# EAGLE design app_jalousie_up_v0_1 (EAGLE 4.16)
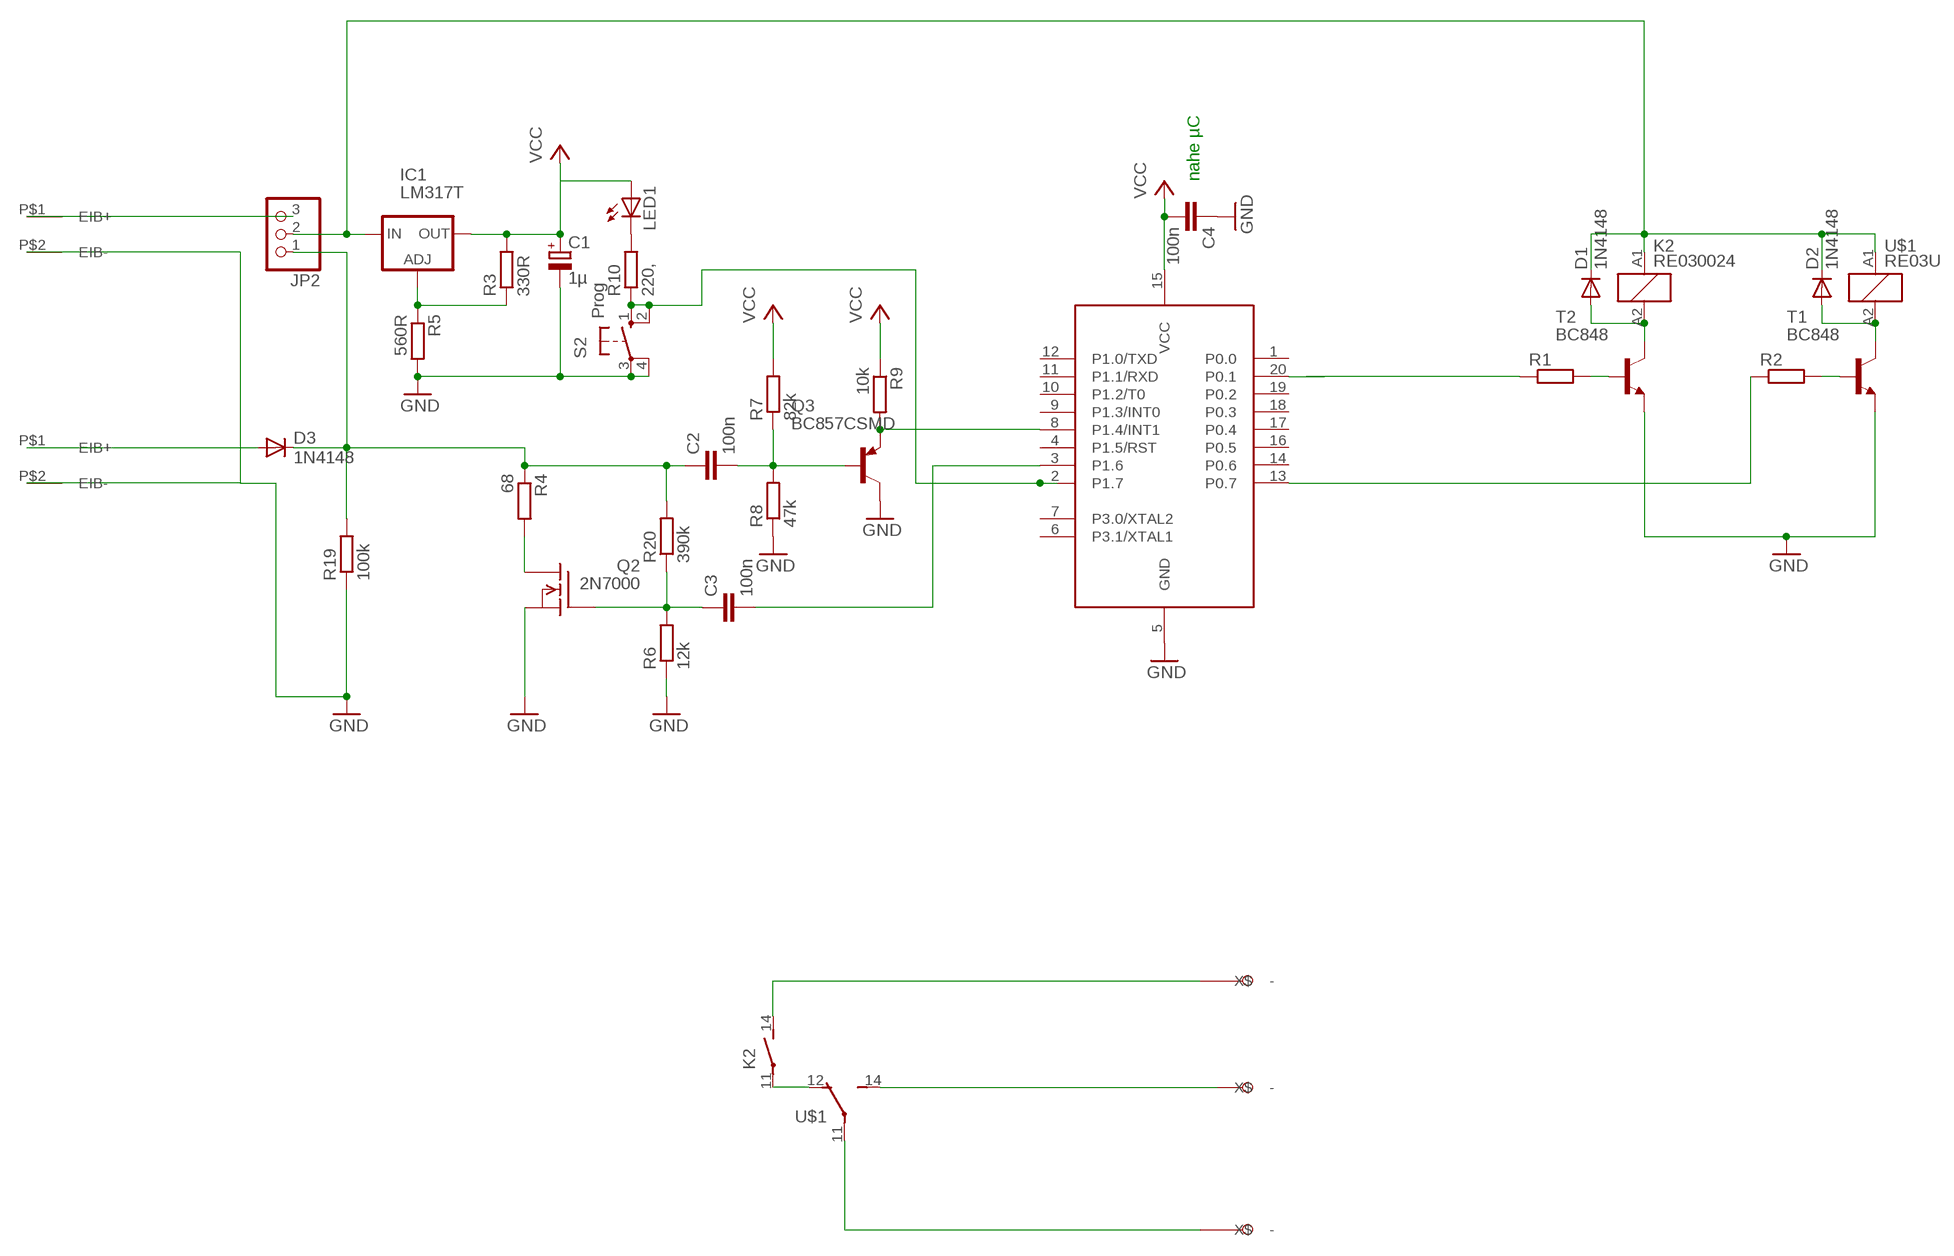
[diagram p0: schematic, sheet 1]

## Parts
C1  1µ  CPOL-EUCT3528  [CT3528]
C2  100n  C-EUC0805  [C0805]
C3  100n  C-EUC0805  [C0805]
C4  100n  C-EUC0805  [C0805]
D1  1N4148  DIODE-SOD80C  [SOD80C]
D2  1N4148  DIODE-SOD80C  [SOD80C]
D3  1N4148  DIODE-SOD80C  [SOD80C]
DOWN  SCHRAUBKLEMME  [SCHRAUBKLEMME_PAC]
IC1  LM317T  LM317L  [317L]
JP2  PINHD-1X3  [1X03]
K2  RE030024  [RE-SCHRACK]
L1  SCHRAUBKLEMME  [SCHRAUBKLEMME_PAC]
LED1  LEDCHIPLED_1206  [CHIPLED_1206]
Q2  2N7000  VN2222KM  [TO237]
Q3  BC857CSMD  [SOT23-BEC]
R1  R-EU_M0805  [M0805]
R2  R-EU_M0805  [M0805]
R3  330R  R-EU_R0805  [R0805]
R4  68  R-EU_R0805  [R0805]
R5  560R  R-EU_R0805  [R0805]
R6  12k  R-EU_R0805  [R0805]
R7  82k  R-EU_R0805  [R0805]
R8  47k  R-EU_R0805  [R0805]
R9  10k  R-EU_R0805  [R0805]
R10  220,  R-EU_R0805  [R0805]
R19  100k  R-EU_R0805  [R0805]
R20  390k  R-EU_R0805  [R0805]
S2  Prog  10-XX_SMD  [B3F-10XX_SMD]
T1  BC848  [SOT23]
T2  BC848  [SOT23]
U1  89LPC922  [DIL20]
U$1  RE03U  [G5Q_1_EU]
U$2  BUSKLEMME  [BUSKLEMME]
U$3  BUSKLEMME  [BUSKLEMME]
UP  SCHRAUBKLEMME  [SCHRAUBKLEMME_PAC]

## Nets
GND: C1.- C4.1 Q2.3(S) Q3.C R5.2 R6.1 R8.1 R19.1 S2.3(P) S2.4(P1) T1.2(E) T2.2(E) U1.5(GND) U$2.P$2(EIB-) U$3.P$2(EIB-)
N$1: K2.11(2:P) U$1.12(14:O)
N$2: L1.P$2(-) U$1.11(14:P)
N$3: DOWN.P$2(-) K2.14(2:S)
N$4: U$1.14(14:S) UP.P$1(X$)
N$5: Q2.1(D) R4.2
N$6: D2.A T1.3(C) U$1.A2
N$7: R2.2 T1.1(B)
N$8: R1.2 T2.1(B)
N$9: D1.A K2.A2 T2.3(C)
N$10: LED1.C R10.2
N$11: Q3.E R9.2 U1.8(P1.4/INT1)
N$12: C2.2 Q3.B R7.1 R8.2
N$13: C3.2 U1.3(P1.6)
N$15: IC1.1(ADJ) R3.1 R5.1
N$16: C2.1 D3.C JP2.1 R4.1 R19.2 R20.2
N$17: R10.1 S2.1(S) S2.2(S1) U1.2(P1.7)
N$18: D1.C D2.C IC1.3(IN) JP2.2 K2.A1 U$1.A1
N$19: R2.1 U1.13(P0.7)
N$20: JP2.3 U$2.P$1(EIB+)
N$21: D3.A U$3.P$1(EIB+)
N$35: C3.1 Q2.2(G) R6.2 R20.1
P0.1: R1.1 U1.20(P0.1)
VCC: C1.+ C4.2 IC1.2(OUT) LED1.A R3.2 R7.2 R9.1 U1.15(VCC)
Unconnected: DOWN.P$1(X$) L1.P$1(X$) U1.1(P0.0) U1.4(P1.5/RST) U1.6(P3.1/XTAL1) U1.7(P3.0/XTAL2) U1.9(P1.3/INT0) U1.10(P1.2/T0) U1.11(P1.1/RXD) U1.12(P1.0/TXD) U1.14(P0.6) U1.16(P0.5) U1.17(P0.4) U1.18(P0.3) U1.19(P0.2) UP.P$2(-)

## Notes on the sheet
- nahe µC

## Library data of the parts
C1 = rcl:CPOL-EU: POLARIZED CAPACITOR, European symbol
C2-C4 = rcl:C-EU: CAPACITOR, European symbol
D1-D3 = diode:DIODE-: DIODE
DOWN L1 UP = freebus:SCHRAUBKLEMME
IC1 = v-reg:LM317L: VOLTAGE REGULATOR
JP2 = pinhead:PINHD-1X3: PIN HEADER
K2 = relay:RE03*: Miniature PCB Relay 1 pole 6 A SCHRACK Source: http://www.schrack.com/.. 5812.pdf
LED1 = led:LED: LED OSRAM: - CHIPLED LG R971, LG N971, LY N971, LG Q971, LY Q971, LO R971, LY R971 LH N974, LH R974 LS Q976, LO Q976, LY Q976 LO Q996 - Hyper CHIPLED LW Q18S LB Q993, LB Q99A, LB R99A - SideLED LS A670, LO A670, LY A670, LG A670, LP A670 LB A673, LV A673, LT A673, LW A673 LH A674 LY A675 LS A676, LA A676, LO A676, LY A676, LW A676 LS A679, LY A679, LG A679 - Hyper Micro SIDELED® LS Y876, LA Y876, LO Y876, LY Y876 LT Y87S - SmartLED LW L88C, LW L88S LB L89C, LB L89S, LG L890 LS L89K, LO L89K, LY L89K LS L896, LA L896, LO L896, LY L896 - TOPLED LS T670, LO T670, LY T670, LG T670, LP T670 LSG T670, LSP T670, LSY T670, LOP T670, LYG T670 LG T671, LOG T671, LSG T671 LB T673, LV T673, LT T673, LW T673 LH T674 LS T676, LA T676, LO T676, LY T676, LB T676, LH T676, LSB T676, LW T676 LB T67C, LV T67C, LT T67C, LS T67K, LO T67K, LY T67K, LW E67C LS E67B, LA E67B, LO E67B, LY E67B, LB E67C, LV E67C, LT E67C LW T67C LS T679, LY T679, LG T679 LS T770, LO T770, LY T770, LG T770, LP T770 LB T773, LV T773, LT T773, LW T773 LH T774 LS E675, LA E675, LY E675, LS T675 LS T776, LA T776, LO T776, LY T776, LB T776 LHGB T686 LT T68C, LB T68C - Hyper Mini TOPLED® LB M676 - Mini TOPLED Santana® LG M470 LS M47K, LO M47K, LY M47K Source: http://www.osram.convergy.de/
Q2 = transistor-fet:VN2222KM: N-Channel Enhancement MOSFET (VMOS); 60V; 0,5A; 7,5Ohm
Q3 = transistor-pnp:BC857*: PNP Transistror
R1-R10 R19 R20 = rcl:R-EU_: RESISTOR, European symbol
S2 = switch-omron:10-XX_SMD
T1 T2 = transistor:BC848: NPN TRANSISTOR
U1 = micro-philips:89LPC922
U$1 = freebus_relay:RE03U
U$2 U$3 = freebus:BUSKLEMME

## Board
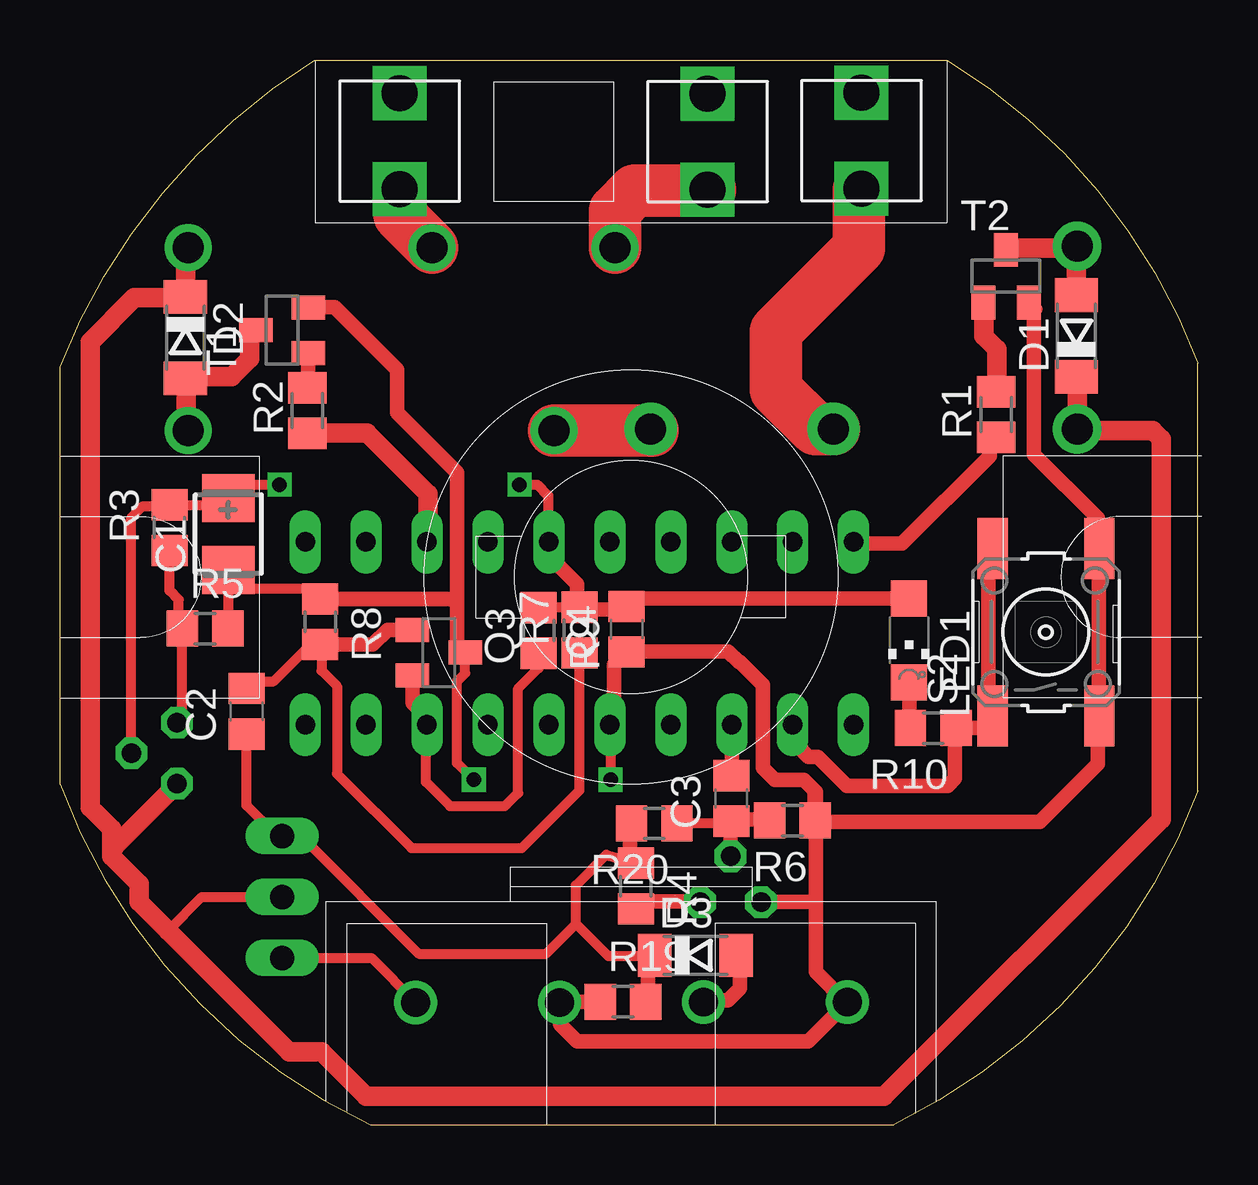
[diagram p1: board, top side]
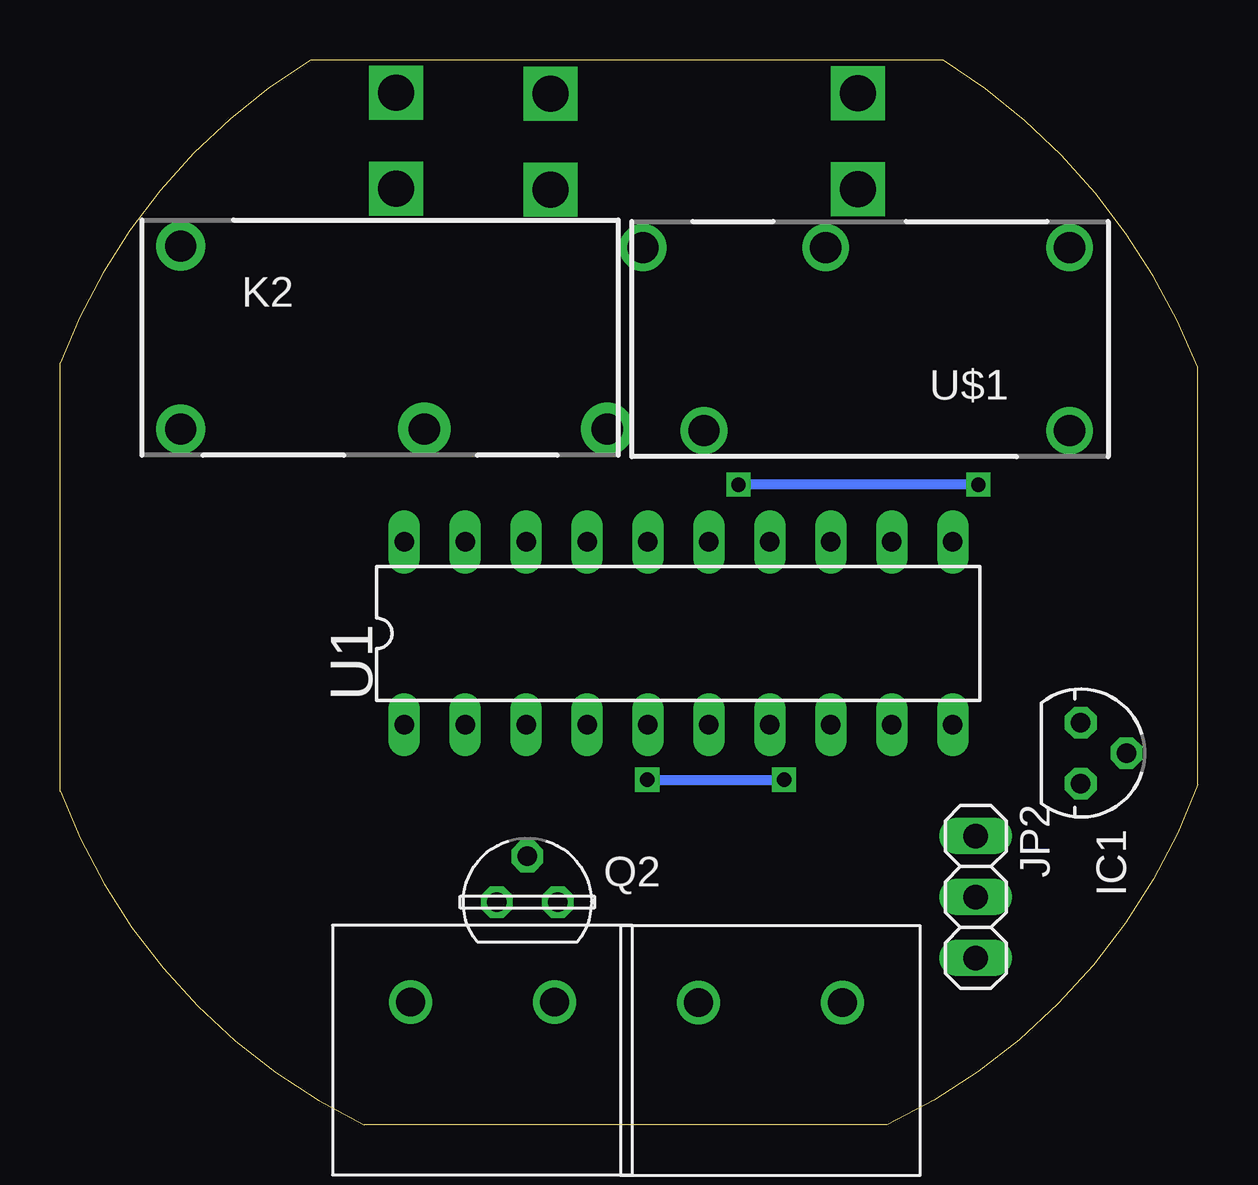
[diagram p2: board, bottom side, seen from below]

Size 47.43 x 44.38 mm. Coordinates in mm from the lower left corner, seen from the top.
Outline: 10.62,44.38 36.96,44.38
Outline: 47.42,13.9 47.43,31.75
Outline: 12.95,0 34.75,0
Outline: 12.95,0 arc-44 0,14.19 0,31.58 arc-36 10.61,44.38
Outline: 36.98,44.38 arc-38 47.43,31.76
Outline: 47.42,13.91 arc-44 34.75,0
Copper layers (1*16): Top 0.035mm / dielectric 1.5mm / Bottom 0.035mm
Design rules "default": minimum track width 10mil, minimum drill 24mil, track to track 8mil, track to pad 8mil, pad to pad 8mil, via to via 8mil, smd to smd 8mil, copper to edge 40mil, drill to drill 8mil, minimum pad ring 10mil, minimum via ring 8mil, stop-mask expansion 4mil, vias tented up to drill 0mil, thermal gap 10mil

### Footprints (pad centres in the part's own frame; a part is rotated, then mirrored left to right if it is on the bottom)
CT3528 = smd 2 x 2.2: + 1.5,0; - -1.5,0
C0805 = smd 1.3 x 1.5: 1 -0.95,0; 2 0.95,0
SOD80C = smd 1.4 x 1.8: A 1.7,0; C -1.7,0
SCHRAUBKLEMME_PAC = drill 1.5 pad 1.93 square: P$1 -2,0; P$2 2,0
317L = drill 0.813 octagon: 1 -1.27,0; 2 0,1.905; 3 1.27,0
1X03 = drill 1.016 long: 1 -2.54,0; 2 0,0; 3 2.54,0
RE-SCHRACK = drill 1.3 pad 2.184 round: 11 8.89,-3.81; 14 1.27,-3.81 | drill 1.3 pad 2.032 round: A1 -8.89,-3.81; A2 -8.89,3.81
CHIPLED_1206 = smd 1.5 x 1.5: A 0,-1.75; C 0,1.75
TO237 = drill 0.813 octagon: 1 1.27,0; 2 0,1.905; 3 -1.27,0
SOT23-BEC = smd 1 x 1.4: B -0.95,-1.1; C 0,1.1; E 0.95,-1.1
M0805 = smd 1.3 x 1.6: 1 -0.95,0; 2 0.95,0
R0805 = smd 1.3 x 1.5: 1 -0.95,0; 2 0.95,0
B3F-10XX_SMD = smd 2.54 x 1.27: 1 -3.493,2.223; 2 3.493,2.223; 3 -3.493,-2.223; 4 3.493,-2.223
SOT23 = smd 1 x 1.4: 1 -0.95,-1.1; 2 0.95,-1.1; 3 0,1.1
DIL20 = drill 0.813 long: 1 -11.43,-3.81; 2 -8.89,-3.81; 3 -6.35,-3.81; 4 -3.81,-3.81; 5 -1.27,-3.81; 6 1.27,-3.81; 7 3.81,-3.81; 8 6.35,-3.81; 9 8.89,-3.81; 10 11.43,-3.81; 11 11.43,3.81; 12 8.89,3.81; 13 6.35,3.81; 14 3.81,3.81; 15 1.27,3.81; 16 -1.27,3.81; 17 -3.81,3.81; 18 -6.35,3.81; 19 -8.89,3.81; 20 -11.43,3.81
G5Q_1_EU = drill 1.3 round: 11 1.27,-3.81; 12 6.35,3.81; 14 8.89,-3.81; A1 -8.89,-3.81; A2 -8.89,3.81
BUSKLEMME = drill 1.2 pad 1.676 round: P$1 0,0; P$2 6,0

### Placement (x,y rotation side)
C1  7.02,24.63 90 top
C2  7.78,17.23 90 top
C3  27.98,13.6 90 top
C4  23.62,20.65 90 top
D1  42.37,32.88 90 top
D2  5.23,32.81 270 top
D3  26.49,7.06 0 top
DOWN  33.41,41.02 270 top
IC1  4.88,15.49 270 bottom
JP2  9.26,9.49 270 bottom
K2  33.51,32.81 0 bottom
L1  14.16,41 270 top
LED1  35.39,20.19 180 top
Q2  27.95,9.28 0 bottom
Q3  15.79,19.68 270 top
R1  39.02,29.6 90 top
R2  10.32,29.77 90 top
R3  4.57,24.89 90 top
R4  24,9.95 270 top
R5  6.05,20.68 0 top
R6  30.53,12.68 180 top
R7  21.65,20.62 90 top
R8  10.85,20.97 270 top
R9  19.95,20.6 270 top
R10  36.4,16.53 180 top
R19  23.47,5.13 0 top
R20  24.77,12.56 180 top
S2  41.1,20.53 90 top
T1  9.26,33.12 90 top
T2  39.43,35.37 0 top
U1  21.65,20.48 0 bottom
U$1  14.24,32.75 180 bottom
U$2  14.82,5.09 180 bottom
U$3  26.82,5.11 180 bottom
UP  26.99,40.98 90 top

### Tracks (layer width: path | path; a pad name or v marks a point on that pad's centre or on a via)
GND  (via drill 0.6)
  Top 0.406: 23.1,18.48 23.05,18.48 23,18.53 | 22.85,16.48 22.92,16.55 U1.5 22.92,16.65 22.85,16.58 22.95,16.48 v22.95,14.38 | R8.1 10.66,21.92 10.25,22.33 7.05,22.33 7,22.38 7,23.03 6.9,23.13 C1.- 7.02,20.66 | 7.02,20.66 R5.2 | 7.02,20.66 7.05,20.63 | Q3.C 16.89,18.82 16.55,18.48 16.55,15.08 v17.25,14.38
  Top 0.61: T2.2 40.65,34 40.6,33.95 40.6,27.93 43.25,25.28 43.25,23.13 43.35,23.03 43.35,22.93 43.4,22.98 43.4,24.1 | 31.45,13.93 31.5,13.88 31.5,12.7 R6.1 31.5,12.66 31.5,12.63 40.85,12.63 43.25,15.03 43.25,16.97 43.3,17.02 | 43.4,24.1 43.4,24.23 | 43.4,24.1 S2.4 43.3,24 43.3,17.02 | 43.3,17.02 43.3,16.98 | 43.3,17.02 S2.3 | 22.6,5.13 R19.1 20.86,5.13 U$2.P$2 20.85,5.12 | 20.85,5.12 20.85,5.28 | 20.85,5.12 20.85,4.18 21.55,3.48 31.19,3.48 U$3.P$2 32.77,5.11 31.5,6.38 31.5,9.23 | U1.5 23.08,16.83 23.1,16.83 23.1,18.48 23.1,19.18 C4.1 23.65,19.73 27.85,19.73 28.3,19.28 28.35,19.28 29.3,18.33 29.3,14.88 29.8,14.38 31,14.38 31.45,13.93 | T1.2 11.45,34.08 14.05,31.48 14.05,29.68 16.55,27.18 16.55,21.83 | Q3.C 16.84,19.73 16.55,19.73 16.55,21.83 | 16.55,21.83 16.4,21.83 16.31,21.92 R8.1 | 31.45,13.93 31.45,12.58 31.5,12.53 31.5,9.23 | Q2.3 31.5,9.28 31.5,9.23
  Bottom 0.406: v22.95,14.38 v17.25,14.38
N$1
  Top 2.184: 24.69,28.94 K2.11 | U$1.12 24.69,28.94 | 24.69,28.94 24.7,28.93
N$2
  Top 2.184: U$1.11 14.16,37.92 L1.P$2
N$3
  Top 2.184: 32.27,29 K2.14 31.48,29 29.85,30.63 29.85,33.08 33.3,36.53 33.3,38.98 33.35,39.03 33.36,39.02 DOWN.P$2
N$4
  Top 2.184: U$1.14 23.13,38.11 23.95,38.93 27.05,38.93 27.1,38.98 UP.P$1
N$5
  Top 0.61: 24.05,9.3 24.05,9.08 | R4.2 24.05,9.3 | 26.8,9.28 26.8,9.23 | 26.8,9.28 Q2.1 | 24.05,9.3 26.8,9.3 26.8,9.28
N$6
  Top 0.813: T1.3 7.9,32.86 7.9,31.93 7.15,31.18 5.3,31.18 D2.A 5.25,31.09 5.25,28.98 5.31,28.98 U$1.A2
N$7
  Top 0.61: R2.2 10.35,30.73 T1.1
N$8
  Top 0.813: T2.1 38.5,34.25 38.5,32.88 39.05,32.33 39.05,30.58 R1.2
N$9
  Top 0.813: D1.A 42.37,36.4 42.4,36.43 K2.A2 42.35,36.57 42.35,36.53 39.49,36.53 T2.3
N$10
  Top 0.61: R10.2 35.4,16.58 LED1.C
N$11
  Top 0.406: R9.2 19.95,19.03 19.1,18.18 19.1,13.83 18.55,13.28 16.25,13.28 15.25,14.28 15.25,16.58 15.3,16.63 U1.8
  Top 0.61: U1.8 15.3,16.98 14.69,17.59 Q3.E
N$12
  Top 0.406: C2.2 7.78,18.25 7.65,18.38 7.75,18.48 8.9,18.48 10.44,20.02 R8.2 10.85,19.93 10.9,19.88 10.9,18.93 11.55,18.28 11.55,14.63 14.65,11.53 19.25,11.53 21.65,13.93 R7.1
  Top 0.61: R8.2 13.04,20.02 13.65,20.63 Q3.B
N$13
  Top 0.61: C3.2 28,14.57 U1.3
N$15
  Top 0.406: 4.88,16.71 4.85,16.68 | IC1.1 4.88,16.71 | 4.88,16.71 5.1,16.93 R5.1 5.05,20.68 4.95,20.78 4.95,21.88 4.57,22.26 R3.1
N$16
  Top 0.406: C2.1 7.78,13.3 9.1,11.98 9.15,12.03 JP2.1 10.05,12.03 14.95,7.13 20.25,7.13 21.5,8.38 | R4.1 22.77,11.25 21.5,9.98 21.5,8.38 | 21.5,8.38 22.85,7.03 24.7,7.03 24.79,6.94 | 24.79,6.94 24.8,6.93 | 24.79,6.94 D3.C
  Top 0.61: R20.2 23.75,12.94 23.75,11.5 R4.1 | R19.2 24.47,5.08 24.5,5.08 24.5,6.77 D3.C
N$17
  Top 0.61: S2.2 38.7,23.85 38.7,17.08 38.84,17.08 S2.1 38.8,16.96 38.8,16.68 38.65,16.53 R10.1 37.3,16.48 37.3,14.43 37,14.13 32.8,14.13 31.6,15.33 31.2,15.33 30.75,15.78 30.75,16.46 U1.2
N$18
  Top 0.406: JP2.2 5.91,9.49 4.5,8.08
  Top 0.813: U$1.A1 5.35,36.38 5.23,36.26 D2.C 5.2,34.48 3.1,34.48 1.25,32.63 1.25,13.23 2.15,12.33 2.15,11.63 | K2.A1 42.42,28.98 | K2.A1 42.4,28.98 | D1.C 42.4,31.15 K2.A1 | K2.A1 42.47,28.93 45.55,28.93 45.9,28.58 45.9,12.73 34.35,1.18 12.75,1.18 10.9,3.03 9.55,3.03 4.5,8.08 3.3,9.28 3.3,10.03 2.15,11.18 2.15,11.63 | 2.15,11.63 2.3,11.63 IC1.3
N$19
  Top 0.813: R2.1 12.8,28.83 15.35,26.28 15.35,24.28 U1.13
N$20
  Top 0.406: U$2.P$1 14.82,5.11 12.98,6.95 JP2.3
N$21
  Top 0.61: U$3.P$1 26.89,5.18 27.85,5.18 28.35,5.68 28.35,6.98 28.41,6.98 D3.A
N$35
  Top 0.406: C3.1 28,12.63 27.93,12.56 R20.1
  Top 0.61: R6.2 29.53,12.73 28,12.73 28,12.67 C3.1 27.95,12.62 Q2.2
P0.1
  Top 0.61: U1.20 33.14,24.23 35.1,24.23 38.75,27.88 38.75,28.63 39,28.63 R1.1
  Top 0.813: U1.20 | 39,28.78 39,28.67 R1.1
VCC  (via drill 0.6)
  Top 0.406: v19.15,26.68 19.9,26.68 20.35,26.23 20.35,24.43 20.3,24.38 U1.15 | R7.2 21.51,21.57 21.5,21.58 21.47,21.55 R9.1 | IC1.2 2.98,25.31 3.45,25.78 4.75,25.78 4.81,25.84 | 4.81,25.84 4.85,25.88 | 4.81,25.84 R3.2 6.76,25.84 7.02,26.1 C1.+ 7.02,26.06 7.05,26.03 7.7,26.68 v9.15,26.68
  Top 0.61: LED1.A 35.7,21.93 | LED1.A | LED1.A 23.95,21.93 C4.2 23.65,21.57 23.65,21.48 21.74,21.48 R7.2 21.55,21.67 21.55,22.53 20.5,23.58 20.5,24.17 U1.15
  Bottom 0.406: v9.15,26.68 v19.15,26.68